# EAGLE design adc_24_bit_arduino-shield_v5 (EAGLE 7.7.0)
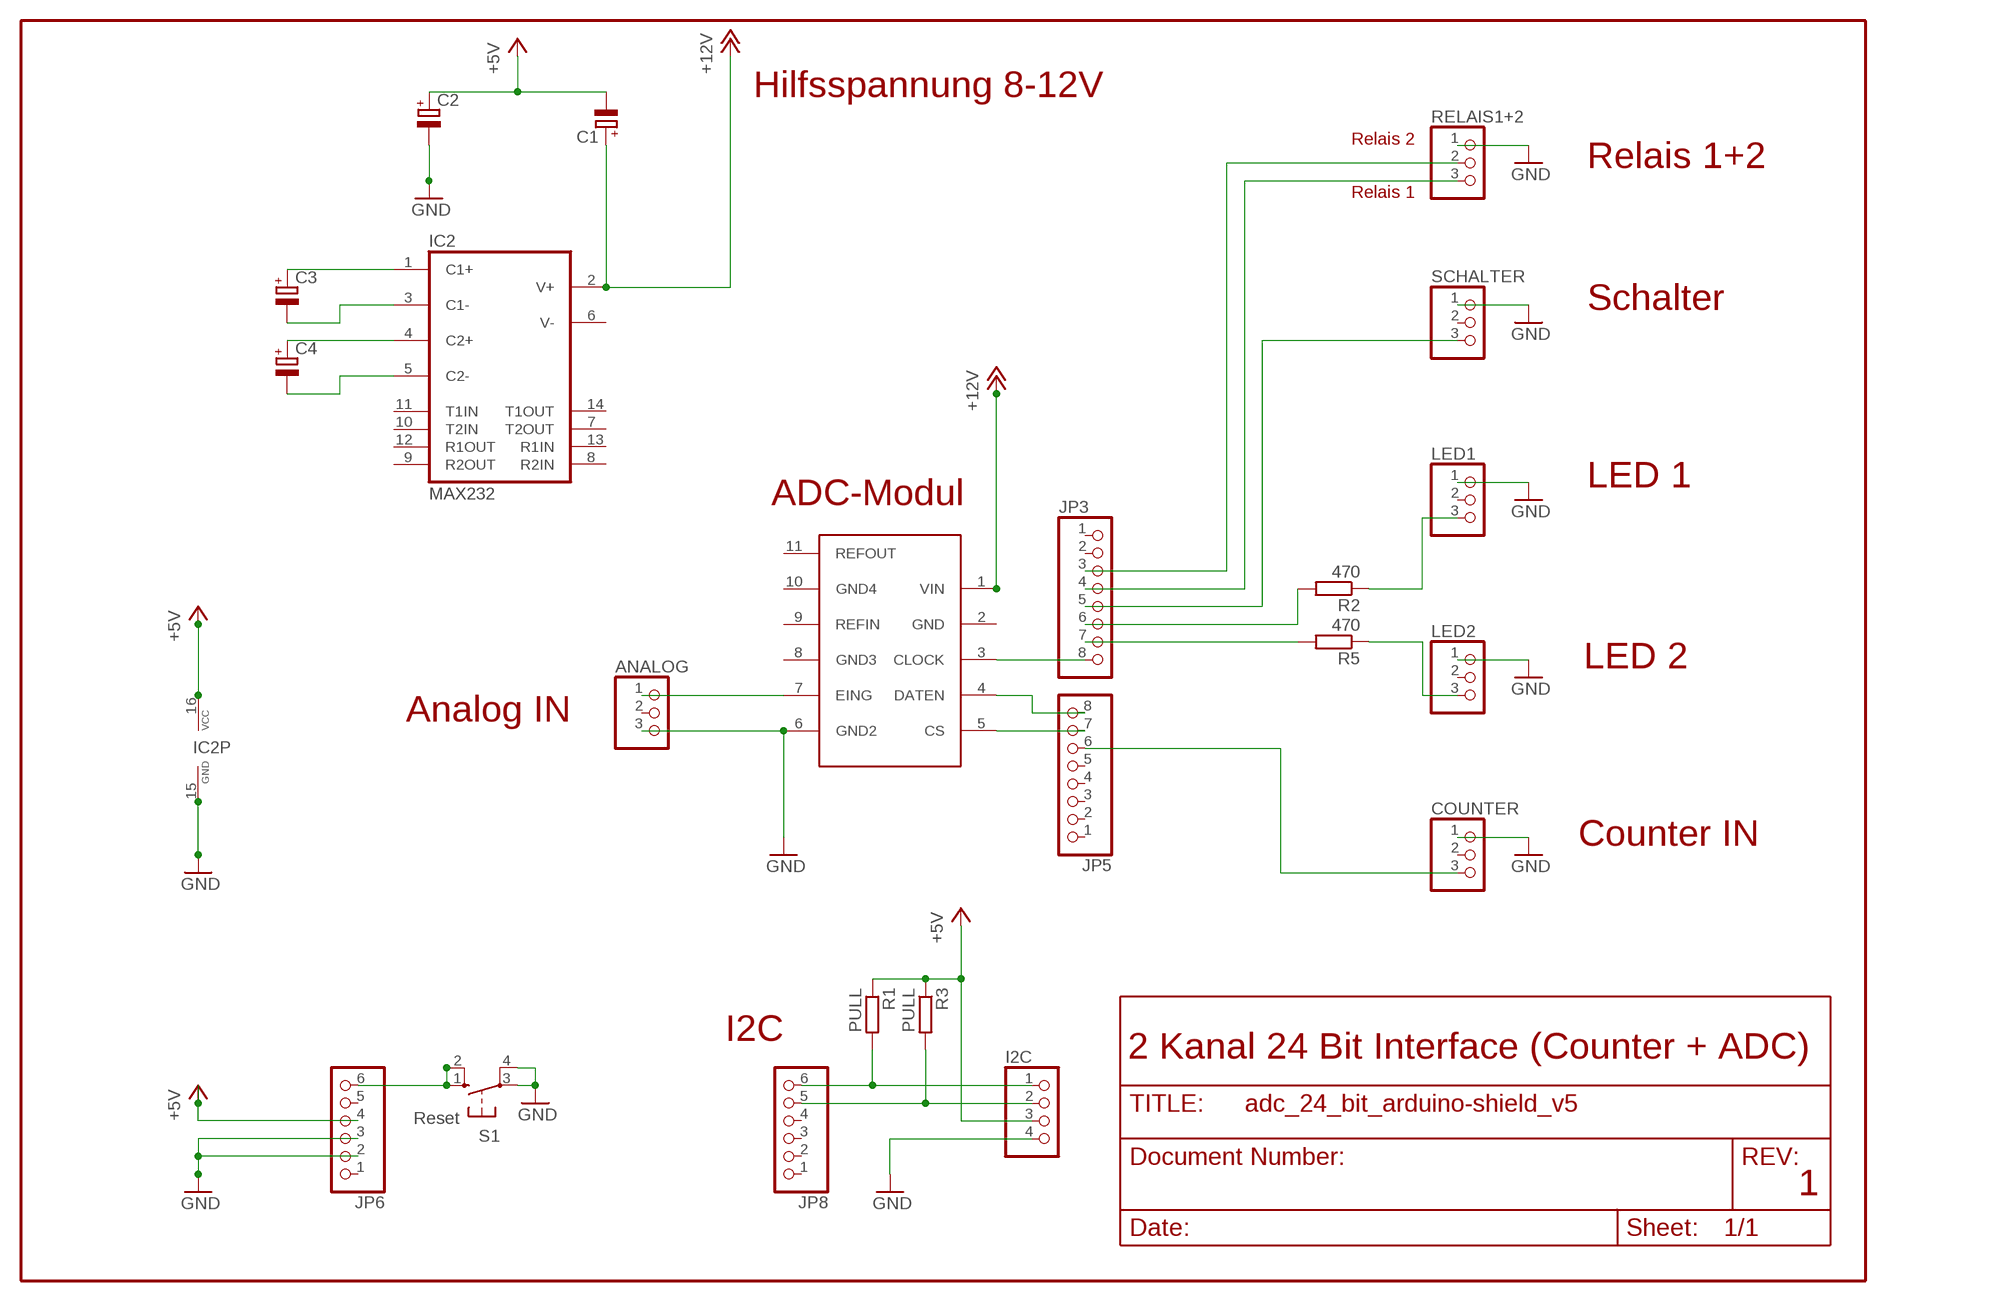
[diagram p0: schematic, sheet 1]

## Parts
ANALOG  PINHD-1X3  [1X03]
C1  CPOL-EUE2-4  [E2-4]
C2  CPOL-EUE2-4  [E2-4]
C3  CPOL-EUE2-4  [E2-4]
C4  CPOL-EUE2-4  [E2-4]
COUNTER  PINHD-1X3  [1X03]
I2C  PINHD-1X4  [1X04]
IC1  MODUL  [TEST]
IC2  MAX232  [DIL16]
JP3  PINHD-1X8CLEANBIG  [1X08-CLEANBIG]
JP5  PINHD-1X8CLEANBIG  [1X08-CLEANBIG]
JP6  PINHD-1X6CB  [1X06-CLEANBIG]
JP8  PINHD-1X6CB  [1X06-CLEANBIG]
LED1  PINHD-1X3  [1X03]
LED2  PINHD-1X3  [1X03]
R1  PULL  R-EU_0207/15  [0207/15]
R2  470  R-EU_0207/15  [0207/15]
R3  PULL  R-EU_0207/15  [0207/15]
R5  470  R-EU_0207/15  [0207/15]
RELAIS1+2  PINHD-1X3  [1X03]
S1  Reset  10-XX  [B3F-10XX]
SCHALTER  PINHD-1X3  [1X03]

## Nets
+5V: C1.- C2.+ I2C.3 IC2.16(VCC) JP6.4 R1.1 R3.1
+12V: C1.+ IC1.1(VIN) IC2.2(V+)
GND: ANALOG.3 C2.- COUNTER.1 I2C.4 IC1.6(GND2) IC2.15(GND) JP6.2 JP6.3 LED1.1 LED2.1 RELAIS1+2.1 S1.3(P) S1.4(P1) SCHALTER.1
N$1: JP6.6 S1.1(S) S1.2(S1)
N$2: IC1.3(CLOCK) JP3.8
N$3: IC1.4(DATEN) JP5.8
N$4: IC1.5(CS) JP5.7
N$5: ANALOG.1 IC1.7(EING)
N$6: C3.+ IC2.1(C1+)
N$7: C3.- IC2.3(C1-)
N$8: C4.+ IC2.4(C2+)
N$9: C4.- IC2.5(C2-)
N$10: COUNTER.3 JP5.6
N$11: LED1.3 R2.1
N$12: JP3.7 R5.2
N$13: JP3.6 R2.2
N$14: LED2.3 R5.1
N$15: I2C.1 JP8.6 R1.2
N$16: I2C.2 JP8.5 R3.2
N$17: JP3.5 SCHALTER.3
N$18: JP3.4 RELAIS1+2.3
N$19: JP3.3 RELAIS1+2.2
Unconnected: ANALOG.2 COUNTER.2 IC1.2(GND) IC1.8(GND3) IC1.9(REFIN) IC1.10(GND4) IC1.11(REFOUT) IC2.6(V-) IC2.7(T2OUT) IC2.8(R2IN) IC2.9(R2OUT) IC2.10(T2IN) IC2.11(T1IN) IC2.12(R1OUT) IC2.13(R1IN) IC2.14(T1OUT) JP3.1 JP3.2 JP5.1 JP5.2 JP5.3 JP5.4 JP5.5 JP6.1 JP6.5 JP8.1 JP8.2 JP8.3 JP8.4 LED1.2 LED2.2 SCHALTER.2

## Notes on the sheet
- Hilfsspannung 8-12V
- Relais 2
- Relais 1+2
- Relais 1
- Schalter
- LED 1
- ADC-Modul
- LED 2
- Analog IN
- Counter IN
- I2C
- 2 Kanal 24 Bit Interface (Counter + ADC)
- 1

## Library data of the parts
ANALOG COUNTER LED1 LED2 RELAIS1+2 SCHALTER = pinhead:PINHD-1X3: PIN HEADER
C1-C4 = rcl:CPOL-EU: POLARIZED CAPACITOR, European symbol
I2C = pinhead:PINHD-1X4: PIN HEADER
IC1 = ELV-Modul:MODUL
IC2 = maxim:MAX232: RS232 TRANSEIVER
JP3 JP5 = carduino:PINHD-1X8: PIN HEADER
JP6 JP8 = carduino:PINHD-1X6: PIN HEADER
R1-R3 R5 = rcl:R-EU_: RESISTOR, European symbol
S1 = switch-omron:10-XX: OMRON SWITCH

## Board
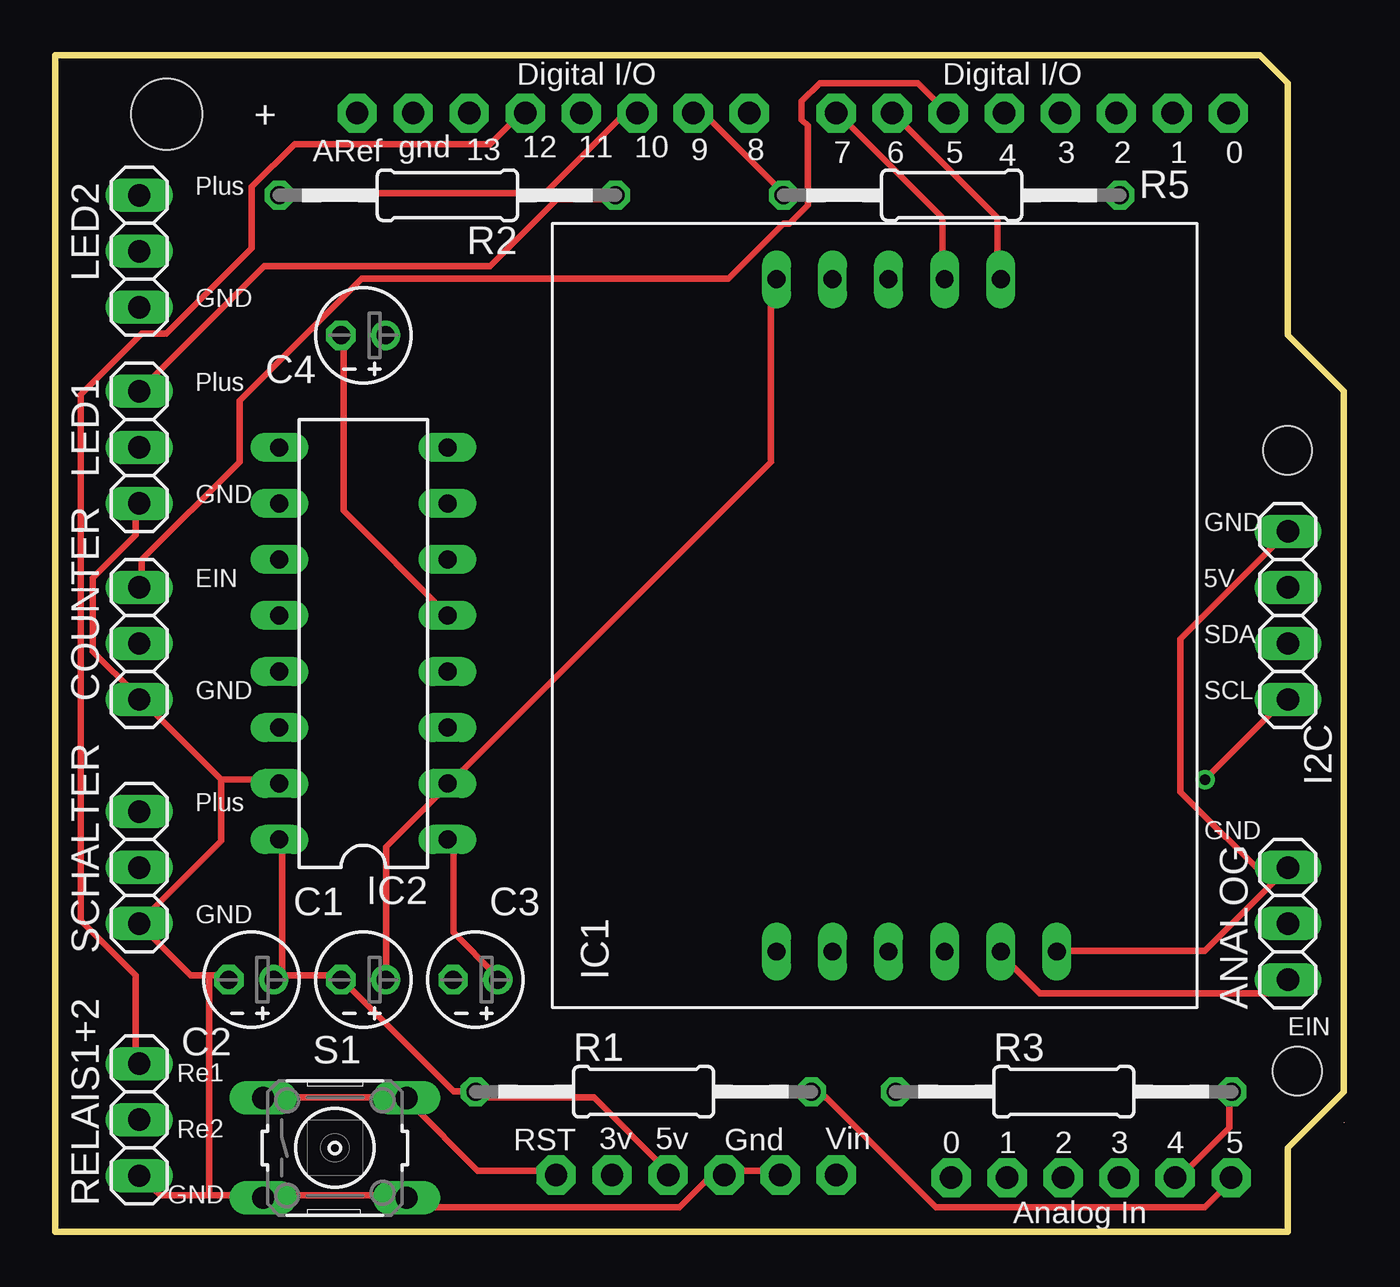
[diagram p1: board, top side]
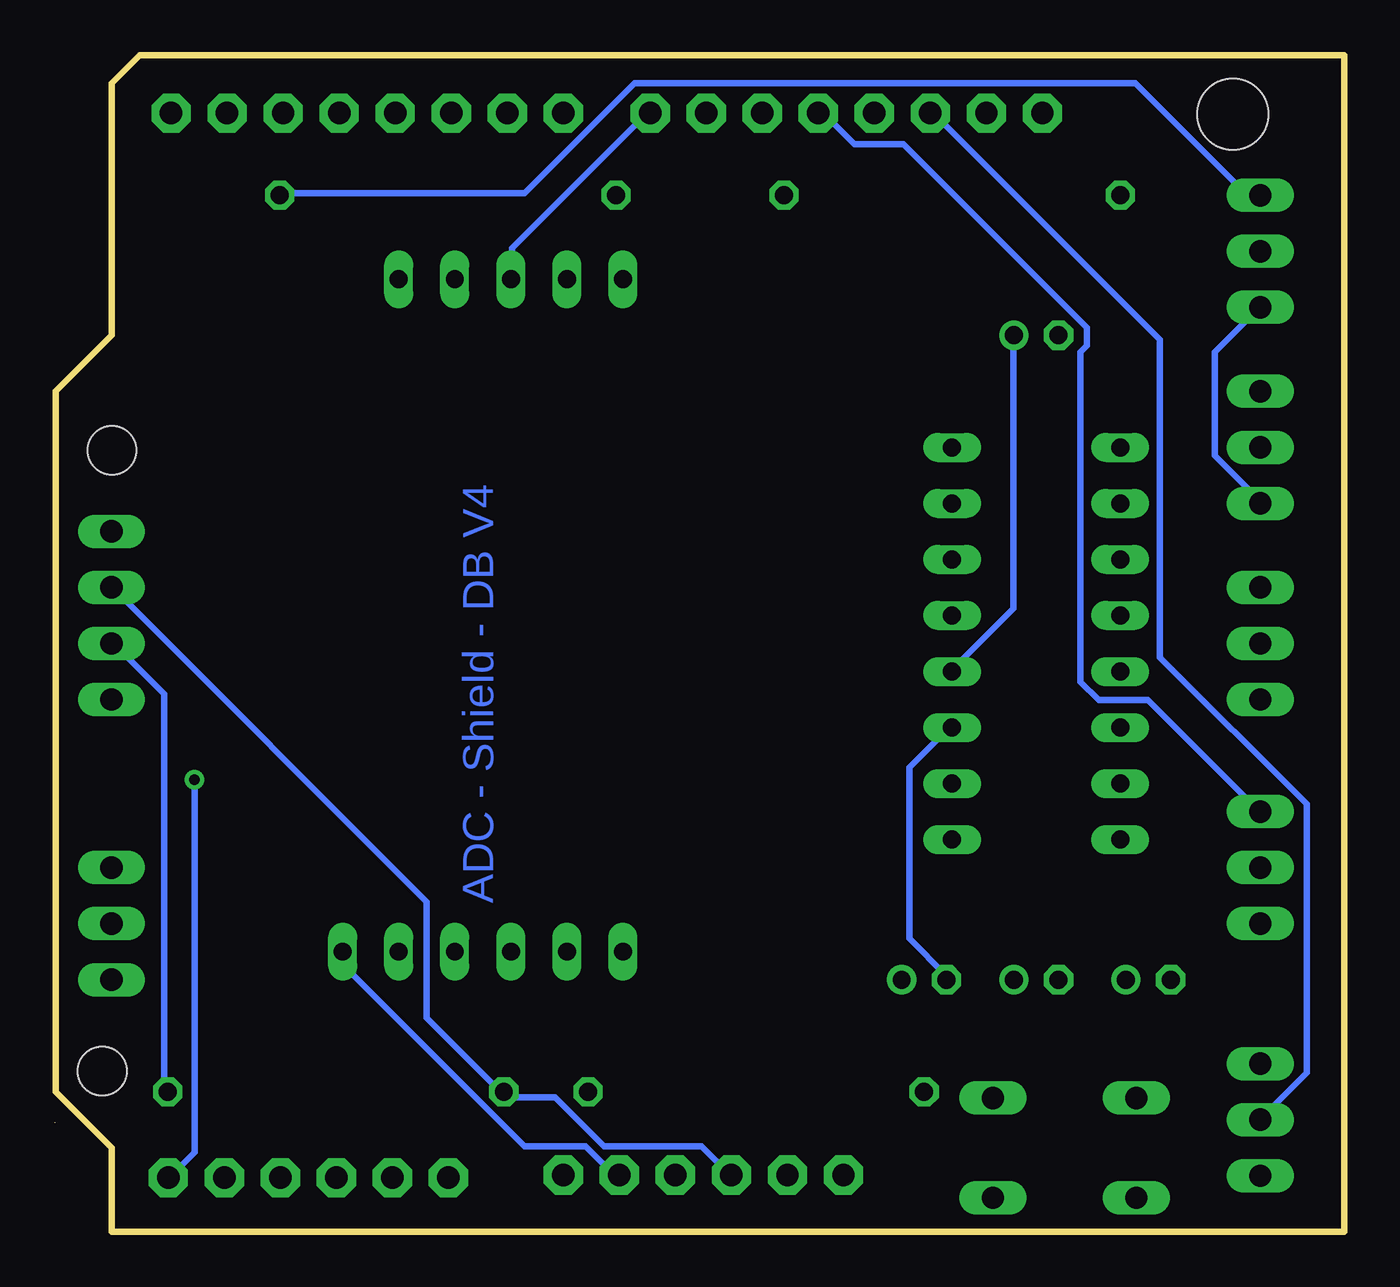
[diagram p2: board, bottom side, seen from below]

Size 58.44 x 53.34 mm. Coordinates in mm from the lower left corner, seen from the top.
Outline: 58.44,4.95 58.44,4.96
Outline: 0,53.34 54.61,53.34 55.88,52.07 55.88,40.64 58.42,38.1 58.42,6.35 55.88,3.81 55.88,0 0,0 0,53.34
Copper layers (1*16): Top 0.035mm / dielectric 1.5mm / Bottom 0.035mm
Design rules "adc_24_bit_arduino-shield_v4 *": minimum track width 0.3mm, minimum drill 19mil, track to track 10mil, track to pad 10mil, pad to pad 0.205mm, via to via 10mil, smd to smd 0mil, copper to edge 10mil, drill to drill 8mil, minimum pad ring 10mil, minimum via ring 8mil, stop-mask expansion 4mil, vias tented up to drill 0mil, thermal gap 10mil
Holes 3.2 mm at 5.06,50.66
Holes 2.2 mm at 55.86,35.42 56.31,7.29

### Footprints (pad centres in the part's own frame; a part is rotated, then mirrored left to right if it is on the bottom)
1X03 = drill 1.016 long: 1 -2.54,0; 2 0,0; 3 2.54,0
E2-4 = drill 0.813 pad 1.27: + -1.016,0 | drill 0.813 pad 1.27 octagon: - 1.016,0
1X04 = drill 1.016 long: 1 -3.81,0; 2 -1.27,0; 3 1.27,0; 4 3.81,0
TEST = drill 0.813 long: 1 33.02,12.7; 2 33.02,10.16; 3 33.02,7.62; 4 33.02,5.08; 5 33.02,2.54; 6 2.54,0; 7 2.54,2.54; 8 2.54,5.08; 9 2.54,7.62; 10 2.54,10.16; 11 2.54,12.7
DIL16 = drill 0.813 long: 1 -8.89,-3.81; 2 -6.35,-3.81; 3 -3.81,-3.81; 4 -1.27,-3.81; 5 1.27,-3.81; 6 3.81,-3.81; 7 6.35,-3.81; 8 8.89,-3.81; 9 8.89,3.81; 10 6.35,3.81; 11 3.81,3.81; 12 1.27,3.81; 13 -1.27,3.81; 14 -3.81,3.81; 15 -6.35,3.81; 16 -8.89,3.81
1X08-CLEANBIG = drill 1.016 pad 1.778 octagon: 1 -8.89,0; 2 -6.35,0; 3 -3.81,0; 4 -1.27,0; 5 1.27,0; 6 3.81,0; 7 6.35,0; 8 8.89,0
1X06-CLEANBIG = drill 1.016 pad 1.778 octagon: 1 -6.35,0; 2 -3.81,0; 3 -1.27,0; 4 1.27,0; 5 3.81,0; 6 6.35,0
0207/15 = drill 0.813 octagon: 1 -7.62,0; 2 7.62,0
B3F-10XX = drill 1.016 long: 1 -3.251,2.261; 2 3.251,2.261; 3 -3.251,-2.261; 4 3.251,-2.261

### Placement (x,y rotation side)
ANALOG  55.88,13.97 90 top
C1  13.97,11.43 180 top
C2  8.89,11.43 180 top
C3  19.05,11.43 180 top
C4  13.97,40.64 180 top
COUNTER  3.81,26.67 90 top
I2C  55.88,27.94 90 top
IC1  45.4,10.16 90 top
IC2  13.97,26.67 90 top
JP3  22.58,50.71 0 top
JP5  44.29,50.71 180 top
JP6  29.05,2.58 180 top
JP8  46.96,2.45 0 top
LED1  3.81,35.56 90 top
LED2  3.81,44.45 90 top
R1  26.67,6.35 0 top
R2  17.78,46.99 180 top
R3  45.72,6.35 0 top
R5  40.64,46.99 180 top
RELAIS1+2  3.81,5.08 90 top
S1  12.68,3.8 0 top
SCHALTER  3.81,16.51 90 top

### Tracks (layer width: path | path; a pad name or v marks a point on that pad's centre or on a via)
+5V
  Top 0.3: 10.3,11.63 12.79,11.63 C1.- 13.07,11.36 18.05,6.37 18.88,6.37 R1.1 19.16,6.09 24.42,6.09 27.75,2.77 JP6.4 | 10.3,11.63 10.02,11.63 C2.+ 10.3,11.63 | 10.3,11.63 10.3,17.73 IC2.16
  Bottom 0.3: JP6.4 28.02,2.77 29.13,3.88 33.56,3.88 35.78,6.09 38,6.09 R3.1 38.27,6.37 41.6,9.7 41.6,14.96 55.72,29.09 I2C.3
+12V
  Top 0.3: C1.+ 15,11.63 15,17.45 17.77,20.22 IC2.2 18.05,20.5 32.46,34.9 32.46,42.94 IC1.1
GND
  Top 0.3: 6.97,11.63 6.14,11.63 3.92,13.85 SCHALTER.1 3.92,14.13 7.53,17.73 7.53,20.5 | 6.97,11.63 7.8,11.63 C2.- | 7.53,20.5 10.02,20.5 IC2.15 | 7.53,20.5 3.92,24.1 COUNTER.1 3.65,24.38 1.71,26.32 1.71,29.64 3.65,31.58 3.65,32.96 LED1.1 | 55.17,15.79 55.72,16.34 ANALOG.3 55.17,15.79 | 55.17,15.79 52.12,12.74 45.48,12.74 IC1.6 | 55.17,15.79 51.02,19.94 51.02,26.87 55.72,31.58 I2C.4 | JP6.2 32.73,2.77 30.52,2.77 JP6.3 30.24,2.49 29.69,2.49 28.3,1.11 16.39,1.11 16.11,1.39 S1.4 15.84,1.66 9.46,1.66 S1.3 9.19,1.66 6.97,1.66 | 6.97,1.66 4.76,1.66 3.92,2.49 RELAIS1+2.1 | 6.97,1.66 6.97,11.63
  Bottom 0.3: LED1.1 3.92,33.24 5.86,35.18 5.86,39.89 3.92,41.83 LED2.1 | IC1.6 45.2,12.46 45.2,11.91 37.16,3.88 34.4,3.88 33.01,2.49 JP6.2
N$1
  Top 0.3: S1.1 9.46,6.09 15.84,6.09 S1.2 16.11,5.82 19.16,2.77 22.48,2.77 JP6.6
N$2
  Bottom 0.3: IC1.3 37.72,43.21 37.72,44.6 31.62,50.69 JP3.8
N$3
  Top 0.3: IC1.4 40.21,43.21 40.21,45.98 35.5,50.69 JP5.8
N$4
  Top 0.3: IC1.5 42.7,43.21 42.7,45.98 38,50.69 JP5.7
N$5
  Top 0.3: IC1.7 42.98,12.46 44.64,10.8 55.17,10.8 55.72,11.36 ANALOG.1
N$6
  Top 0.3: IC2.1 18.05,17.73 18.05,13.57 19.99,11.63 C3.+
N$7
  Bottom 0.3: IC2.3 18.05,22.71 19.71,21.05 19.71,13.3 18.05,11.63 C3.-
N$8
  Bottom 0.3: C4.+ 15,40.44 15,28.25 17.77,25.48 IC2.4
N$9
  Top 0.3: C4.- 13.07,40.44 13.07,32.69 17.77,27.98 IC2.5
N$10
  Top 0.3: COUNTER.3 3.92,29.36 3.92,30.47 8.36,34.9 8.36,37.67 13.9,43.21 30.52,43.21 33.01,45.7 33.29,45.7 34.12,46.54 34.12,50.14 33.84,50.41 33.84,51.24 34.67,52.08 39.1,52.08 40.21,50.97 JP5.6
N$11
  Top 0.3: R2.1 25.25,46.81 22.76,46.81 19.71,43.77 9.46,43.77 3.92,38.23 LED1.3
N$12
  Top 0.3: R5.2 33.01,47.09 29.13,50.97 JP3.7
N$13
  Top 0.3: R2.2 10.3,47.09 22.21,47.09 25.81,50.69 26.36,50.69 JP3.6
N$14
  Bottom 0.3: R5.1 48.24,47.09 37.16,47.09 32.18,52.08 9.46,52.08 4.48,47.09 3.92,47.09 LED2.3
N$15  (via drill 0.48)
  Top 0.3: R1.2 34.4,6.09 34.95,6.09 39.94,1.11 52.12,1.11 53.23,2.22 JP8.6 | v52.12,20.5 55.72,24.1 I2C.1
  Bottom 0.3: v52.12,20.5 52.12,3.6 53.23,2.49 JP8.6
N$16
  Top 0.3: R3.2 53.23,6.09 53.23,4.71 51.02,2.49 JP8.5
  Bottom 0.3: I2C.2 55.72,26.59 53.51,24.38 53.51,6.37 R3.2
N$17
  Bottom 0.3: SCHALTER.3 3.92,19.11 8.91,24.1 11.13,24.1 11.96,24.93 11.96,39.89 11.68,40.16 11.68,41 19.99,49.31 22.21,49.31 23.59,50.69 JP3.5
N$18
  Top 0.3: RELAIS1+2.3 3.65,7.76 3.65,11.63 1.16,14.13 1.16,37.95 3.92,40.72 5.03,40.72 8.91,44.6 8.91,47.37 10.85,49.31 19.71,49.31 21.1,50.69 JP3.4
N$19
  Bottom 0.3: RELAIS1+2.2 3.65,5.26 1.71,7.2 1.71,19.39 8.36,26.04 8.36,40.44 18.61,50.69 JP3.3

### Text on the board
Bottom: ADC - Shield - DB V4
tPlace: Digital I/O | Digital I/O | + | ARef | gnd | 13 | 12 | 11 | 10 | 9 | 8 | 7 | 6 | 5 | 4 | 3 | 2 | 1 | 0 | RST | 3v | 5v | Vin | Gnd | 0 | 1 | 2 | 3 | 4 | 5 | Analog In
tNames: Plus | GND | Plus | GND | GND | EIN | 5V | SDA | GND | SCL | Plus | GND | GND | EIN | Re1 | Re2 | GND